# EAGLE design ardunio-physics-board-v3 (EAGLE 9.6.2)
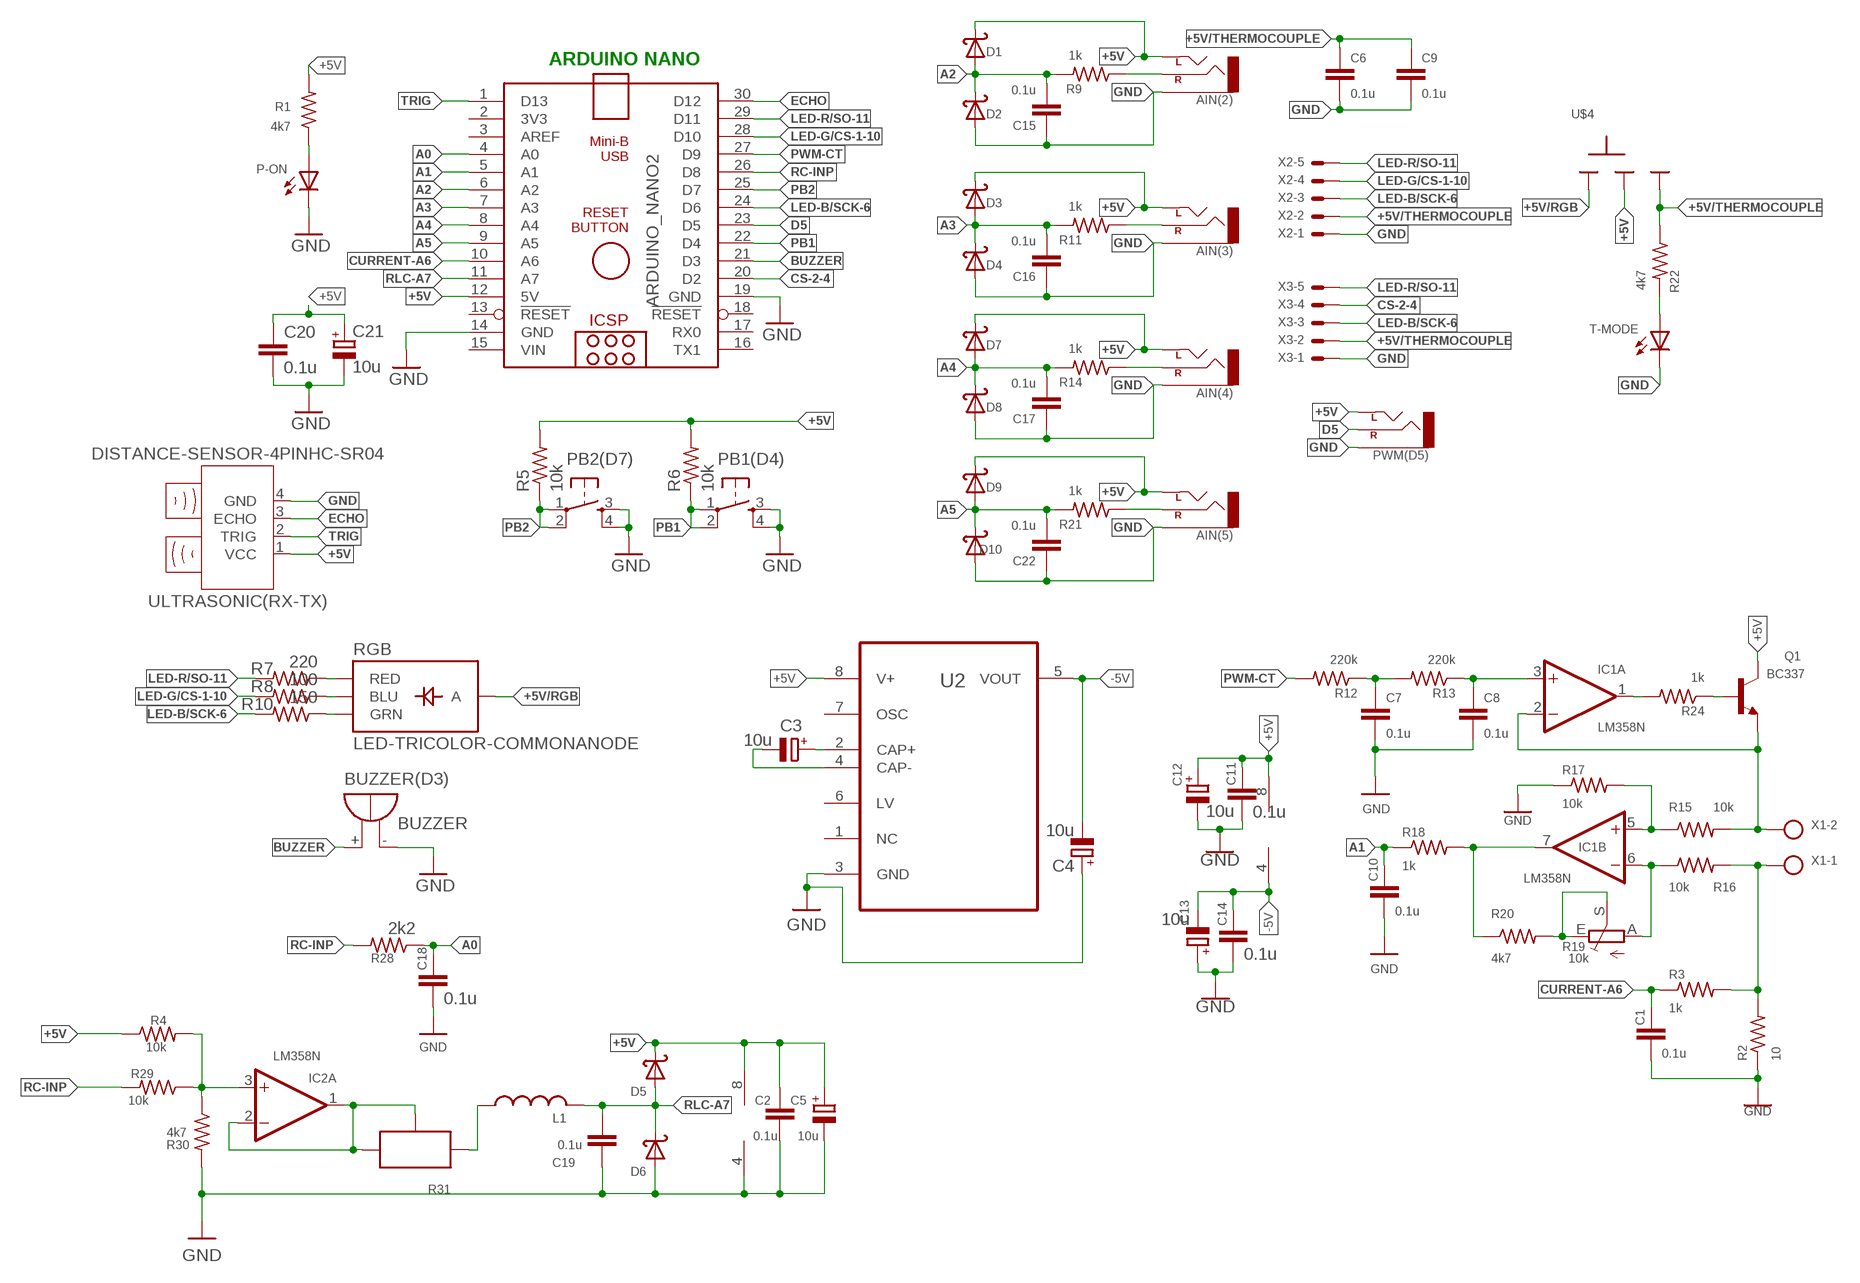
[diagram p0: schematic, sheet 1]

## Parts
AIN(2)  AUX-CONNECTOR_CEDT_JANUARY_2015_V5_AUDIO-JACKPTH  [AUX-CONNECTOR_CEDT_JANUARY_2015_V5_AUDIO-JACK]
AIN(3)  AUX-CONNECTOR_CEDT_JANUARY_2015_V5_AUDIO-JACKPTH  [AUX-CONNECTOR_CEDT_JANUARY_2015_V5_AUDIO-JACK]
AIN(4)  AUX-CONNECTOR_CEDT_JANUARY_2015_V5_AUDIO-JACKPTH  [AUX-CONNECTOR_CEDT_JANUARY_2015_V5_AUDIO-JACK]
AIN(5)  AUX-CONNECTOR_CEDT_JANUARY_2015_V5_AUDIO-JACKPTH  [AUX-CONNECTOR_CEDT_JANUARY_2015_V5_AUDIO-JACK]
ARDUINO_NANO2  ARDUINONANOV30_ARDUINO_NANO  [ARDUINONANOV30_ARDUINO_NANO]
BUZZER(D3)  BUZZER  [F/TMB]
C1  0.1u  C-EU025-025X050  [C025-025X050]
C2  0.1u  C-EU025-025X050  [C025-025X050]
C3  10u  CPOL-EUTT2D5  [TT2D5]
C4  10u  CPOL-EUTT2D5  [TT2D5]
C5  10u  CPOL-EUTT2D5  [TT2D5]
C6  0.1u  C-EU025-024X044  [C025-024X044]
C7  0.1u  C-EU025-025X050  [C025-025X050]
C8  0.1u  C-EU025-025X050  [C025-025X050]
C9  0.1u  C-EU025-024X044  [C025-024X044]
C10  0.1u  C-EU025-025X050  [C025-025X050]
C11  0.1u  C-EU025-025X050  [C025-025X050]
C12  10u  CPOL-EUTT2D5  [TT2D5]
C13  10u  CPOL-EUTT2D5  [TT2D5]
C14  0.1u  C-EU025-025X050  [C025-025X050]
C15  0.1u  C-EU025-024X044  [C025-024X044]
C16  0.1u  C-EU025-024X044  [C025-024X044]
C17  0.1u  C-EU025-024X044  [C025-024X044]
C18  0.1u  C-EU025-025X050  [C025-025X050]
C19  0.1u  C-EU025-025X050  [C025-025X050]
C20  0.1u  C-EU025-024X044  [C025-024X044]
C21  10u  CPOL-EUE2.5-5  [E2,5-5]
C22  0.1u  C-EU025-024X044  [C025-024X044]
D1  1N5819  [DO41-10]
D2  1N5819  [DO41-10]
D3  1N5819  [DO41-10]
D4  1N5819  [DO41-10]
D5  1N5819  [DO41-10]
D6  1N5819  [DO41-10]
D7  1N5819  [DO41-10]
D8  1N5819  [DO41-10]
D9  1N5819  [DO41-10]
D10  1N5819  [DO41-10]
IC1  LM358N  [DIL08]
IC2  LM358N  [DIL08]
L1  L-US6000-XXX-RC  [6000-XXXX-RC]
P-ON  LED3MM  [LED3MM]
PB1(D4)  OMRON_SWITCH_40-XX  [B3F-40XX]
PB2(D7)  OMRON_SWITCH_40-XX  [B3F-40XX]
PWM(D5)  AUX-CONNECTOR_CEDT_JANUARY_2015_V5_AUDIO-JACKPTH  [AUX-CONNECTOR_CEDT_JANUARY_2015_V5_AUDIO-JACK]
Q1  BC337  [TO92]
R1  4k7  R-US_0204/7  [0204/7]
R2  10  RESISTOR0207/10  [0207/10]
R3  1k  R-US_0204/7  [0204/7]
R4  10k  R-US_0207/10  [0207/10]
R5  10k  R-US_0204/7  [0204/7]
R6  10k  R-US_0204/7  [0204/7]
R7  220  R-US_0207/10  [0207/10]
R8  100  R-US_0207/10  [0207/10]
R9  1k  R-US_0204/7  [0204/7]
R10  150  R-US_0207/10  [0207/10]
R11  1k  R-US_0204/7  [0204/7]
R12  220k  R-US_0207/10  [0207/10]
R13  220k  R-US_0204/7  [0204/7]
R14  1k  R-US_0204/7  [0204/7]
R15  10k  R-US_0204/7  [0204/7]
R16  10k  R-US_0204/7  [0204/7]
R17  10k  R-US_0204/7  [0204/7]
R18  1k  R-US_0204/7  [0204/7]
R19  10k  TRIM_EU-RJ9W  [RJ9W]
R20  4k7  R-US_0204/7  [0204/7]
R21  1k  R-US_0204/7  [0204/7]
R22  4k7  R-US_0204/7  [0204/7]
R24  1k  R-US_0204/7  [0204/7]
R28  2k2  R-US_0207/10  [0207/10]
R29  10k  R-US_0204/7  [0204/7]
R30  4k7  R-US_0207/10  [0207/10]
R31  POTNORMAL  [RJ9W]
RGB  LED-TRICOLOR-COMMONANODE  [LED-TRICOLOR-THROUGHHOLE]
T-MODE  LED3MM  [LED3MM]
U2  ICL7660CPAZ_ICL7660CPAZ  [ICL7660CPAZ_DIP254P762X533-8]
U$4  SLIDESWITCH-BIG  [BIGSWITCH]
ULTRASONIC(RX-TX)  DISTANCE-SENSOR-4PINHC-SR04  [HC-SR04]
X1  AK500/2-H  [AK500/2-H]
X2  JST-XH-05-PIN-LONG-PAD  [JST-XH-05-PACKAGE-LONG-PAD]
X3  JST-XH-05-PIN-LONG-PAD  [JST-XH-05-PACKAGE-LONG-PAD]

## Nets
+5V [POWER]: AIN(2).TIP(LEFT) AIN(3).TIP(LEFT) AIN(4).TIP(LEFT) AIN(5).TIP(LEFT) ARDUINO_NANO2.12(5V) C2.1 C5.+ C11.1 C12.+ C20.1 C21.+ D1.C D3.C D5.C D7.C D9.C IC1.8(P:V+) IC2.8(P:V+) PWM(D5).TIP(LEFT) Q1.3(C) R1.2 R4.1 R5.2 R6.2 U2.8(V+) U$4.2 ULTRASONIC(RX-TX).1(VCC)
+5V/RGB: RGB.ANODE(A) U$4.1
+5V/THERMOCOUPLE: C6.1 C9.1 R22.1 U$4.3 X2.2 X3.2
-5V: C4.- C13.- C14.1 IC1.4(P:V-) U2.5(VOUT)
A0: ARDUINO_NANO2.4(A0) C18.1 R28.1
A1: ARDUINO_NANO2.5(A1) C10.1 R18.1
A2: ARDUINO_NANO2.6(A2) C15.2 D1.A D2.C R9.2
A3: ARDUINO_NANO2.7(A3) C16.2 D3.A D4.C R11.2
A4: ARDUINO_NANO2.8(A4) C17.2 D7.A D8.C R14.2
A5: ARDUINO_NANO2.9(A5) C22.2 D9.A D10.C R21.2
BUZZER: ARDUINO_NANO2.21(D3) BUZZER(D3).+
CS-2-4: ARDUINO_NANO2.20(D2) X3.4
CURRENT-A6: ARDUINO_NANO2.10(A6) C1.1 R3.1
D5: ARDUINO_NANO2.23(D5) PWM(D5).RING(RIGHT)
ECHO: ARDUINO_NANO2.30(D12) ULTRASONIC(RX-TX).3(ECHO)
GND [POWER]: AIN(2).SLEEVE AIN(3).SLEEVE AIN(4).SLEEVE AIN(5).SLEEVE ARDUINO_NANO2.14(GND) ARDUINO_NANO2.19(GND) BUZZER(D3).- C1.2 C2.2 C4.+ C5.- C6.2 C7.2 C8.2 C9.2 C10.2 C11.2 C12.- C13.+ C14.2 C15.1 C16.1 C17.1 C18.2 C19.2 C20.2 C21.- C22.1 D2.A D4.A D6.A D8.A D10.A IC2.4(P:V-) P-ON.K(C) PB1(D4).3(S) PB1(D4).4(S1) PB2(D7).3(S) PB2(D7).4(S1) PWM(D5).SLEEVE R2.1 R17.1 R30.2 T-MODE.K(C) U2.3(GND) ULTRASONIC(RX-TX).4(GND) X2.1 X3.1
LED-B/SCK-6: ARDUINO_NANO2.24(D6) R10.2 X2.3 X3.3
LED-G/CS-1-10: ARDUINO_NANO2.28(D10) R8.2 X2.4
LED-R/SO-11: ARDUINO_NANO2.29(D11) R7.2 X2.5 X3.5
N$1: IC1.2(A:-IN) Q1.1(E) R15.2 X1.2
N$2: R7.1 RGB.RED
N$3: R8.1 RGB.BLU
N$4: R10.1 RGB.GRN
N$5: IC1.1(A:OUT) R24.2
N$6: C8.1 IC1.3(A:+IN) R13.1
N$7: IC2.3(A:+IN) R4.2 R29.1 R30.1
N$9: C3.+ U2.2(CAP+)
N$10: C3.- U2.4(CAP-)
N$11: C7.1 R12.1 R13.2
N$12: R2.2 R3.2 R16.2 X1.1
N$13: P-ON.A R1.1
N$14: Q1.2(B) R24.1
N$15: IC2.1(A:OUT) IC2.2(A:-IN) R31.A R31.S
N$16: AIN(2).RING(RIGHT) R9.1
N$17: IC1.5(B:+IN) R15.1 R17.2
N$18: IC1.6(B:-IN) R16.1 R19.A
N$20: R19.E R19.S R20.2
N$21: IC1.7(B:OUT) R18.2 R20.1
N$22: AIN(3).RING(RIGHT) R11.1
N$27: R22.2 T-MODE.A
N$28: L1.1 R31.E
N$29: AIN(4).RING(RIGHT) R14.1
N$31: AIN(5).RING(RIGHT) R21.1
PB1: ARDUINO_NANO2.22(D4) PB1(D4).1(P) PB1(D4).2(P1) R6.1
PB2: ARDUINO_NANO2.25(D7) PB2(D7).1(P) PB2(D7).2(P1) R5.1
PWM-CT: ARDUINO_NANO2.27(D9) R12.2
RC-INP: ARDUINO_NANO2.26(D8) R28.2 R29.2
RLC-A7: ARDUINO_NANO2.11(A7) C19.1 D5.A D6.C L1.2
TRIG: ARDUINO_NANO2.1(D13) ULTRASONIC(RX-TX).2(TRIG)
Unconnected: ARDUINO_NANO2.2(3V3) ARDUINO_NANO2.3(AREF) ARDUINO_NANO2.13(!RESET) ARDUINO_NANO2.16(TX1) ARDUINO_NANO2.17(RX0) ARDUINO_NANO2.18(!RESET) IC2.5(B:+IN) IC2.6(B:-IN) IC2.7(B:OUT) U2.1(NC) U2.6(LV) U2.7(OSC)

## Notes on the sheet
- ARDUINO NANO

## Power pins joined to a net without a drawn wire
VIN: ARDUINO_NANO2.15(VIN)

## Library data of the parts
AIN(2) AIN(3) AIN(4) AIN(5) PWM(D5) = aux-connector:AUX-CONNECTOR_CEDT_JANUARY_2015_V5_AUDIO-JACK: 3.5mm Audio Jack Simple 3.5mm common PCB mount audio jack. SKU: PRT-08032
ARDUINO_NANO2 = nano:ARDUINONANOV30_ARDUINO_NANO: Arduino Nano V3.0 Overview: The Arduino Nano is a small, complete, and breadboard-friendly board based on the ATmega328 (Arduino Nano 3.x) or ATmega168 (Arduino Nano 2.x). It has more or less the same functionality of the Arduino Duemilanove, but in a different package. It lacks only a DC power jack, and works with a Mini-B USB cable instead of a standard one. The Nano was designed and is being produced by Gravitech. Specifications: Microcontroller Atmel ATmega168 or ATmega328 Operating Voltage (logic level) 5 V Input Voltage (recommended) 7-12 V Input Voltage (limits) 6-20 V Digital I/O Pins 14 (of which 6 provide PWM output) Analog Input Pins 8 DC Current per I/O Pin 40 mA Flash Memory 16 KB (ATmega168) or 32 KB (ATmega328) of which 2 KB used by bootloader SRAM 1 KB (ATmega168) or 2 KB (ATmega328) EEPROM 512 bytes (ATmega168) or 1 KB (ATmega328) Clock Speed 16 MHz Dimensions 0.73" x 1.70" Length 45 mm Width 18 mm Weigth 5 g Power: The Arduino Nano can be powered via the Mini-B USB connection, 6-20V unregulated external power supply (pin 30), or 5V regulated external power supply (pin 27). The power source is automatically selected to the highest voltage source. Memory: The ATmega168 has 16 KB of flash memory for storing code (of which 2 KB is used for the bootloader); the ATmega328 has 32 KB, (also with 2 KB used for the bootloader). The ATmega168 has 1 KB of SRAM and 512 bytes of EEPROM (which can be read and written with the EEPROM library); the ATmega328 has 2 KB of SRAM and 1 KB of EEPROM. Input and Output: Each of the 14 digital pins on the Nano can be used as an input or output, using pinMode(), digitalWrite(), and digitalRead() functions. They operate at 5 volts. Each pin can provide or receive a maximum of 40 mA and has an internal pull-up resistor (disconnected by default) of 20-50 kOhms. In addition, some pins have specialized functions. Visit Arduino - ArduinoBoardNano <https://www.arduino.cc/en/Main/ArduinoBoardNano>
BUZZER(D3) = CEDT_JANUARY_2015_v5:BUZZER: BUZZER Source: Buerklin; OC_FARNELL: unknown; OC_NEWARK: unknown
C1 C2 C6-C11 C14-C20 C22 = rcl:C-EU: CAPACITOR, European symbol; SPICEPREFIX: C
C3-C5 C12 C13 C21 = rcl:CPOL-EU: POLARIZED CAPACITOR, European symbol; SPICEPREFIX: C
D1-D10 = CEDT_JANUARY_2015_v5:1N5819: DIODE general purpose rectifier, 1 A
IC1 IC2 = CEDT_JANUARY_2015_v5:LM358: OP AMP also LM158; LM258; LM2904 Source: http://cache.national.com/ds/LM/LM158.pdf
L1 = rcl:L-US: INDUCTOR, American symbol; SPICEPREFIX: L
P-ON T-MODE = CEDT:LED; OC_FARNELL: unknown
PB1(D4) PB2(D7) = CEDT_JANUARY_2015_v5:OMRON_SWITCH
Q1 = transistor-npn:BC337*: NPN Transistor
R1 R3-R18 R20-R22 R24 R28-R30 = rcl:R-US_: RESISTOR, American symbol; SPICEPREFIX: R
R2 = CEDT_JANUARY_2015_v5:RESISTOR
R19 = pot:TRIM_EU-: POTENTIOMETER
R31 = CEDT_JANUARY_2015_v5:POT
RGB = CEDT_JANUARY_2015_v5:LED-TRICOLOR-COMMONANODE
U2 = CurveTracer_V6:ICL7660CPAZ_ICL7660CPAZ: CMOS Voltage Converters Check prices <https://pricing.snapeda.com/parts/ICL7660CPAZ/Renesas%20Electronics/view-part?ref=eda>; AVAILABILITY: In Stock; DESCRIPTION: Charge Pump Switching Regulator IC Positive or Negative Fixed -Vin, 2Vin 1 Output 45mA 8-DIP (0.300, 7.62mm); MF: Renesas Electronics; MP: ICL7660CPAZ; PACKAGE: DIP-8 Intersil; PRICE: None
U$4 = CEDT_JANUARY_2015_v5:SLIDESWITCH
ULTRASONIC(RX-TX) = Tinkercad:DISTANCE-SENSOR-4PIN
X1 = con-ptr500:AK500/2-H: CONNECTOR Aug. 2004 / PTR Meßtechnik: Die Bezeichnung der Serie AK505 wurde geändert. Es handelt sich hierbei um AK500 in horizontaler Ausführung.; OC_FARNELL: unknown; OC_NEWARK: unknown
X2 X3 = Rembrandt Electronics - JST XH Connectors v1-0:JST-XH-05-PIN: JST XH Connector 2 Pin Wire to board connector. Pitch: 2,54 mm, (0.100") Number of pins: 5 Created by Rembrandt Electronics www.rembrandtelectronics.com

## Net classes
0 default: width 0.813 mm
1 POWER: width 1.016 mm

## Board
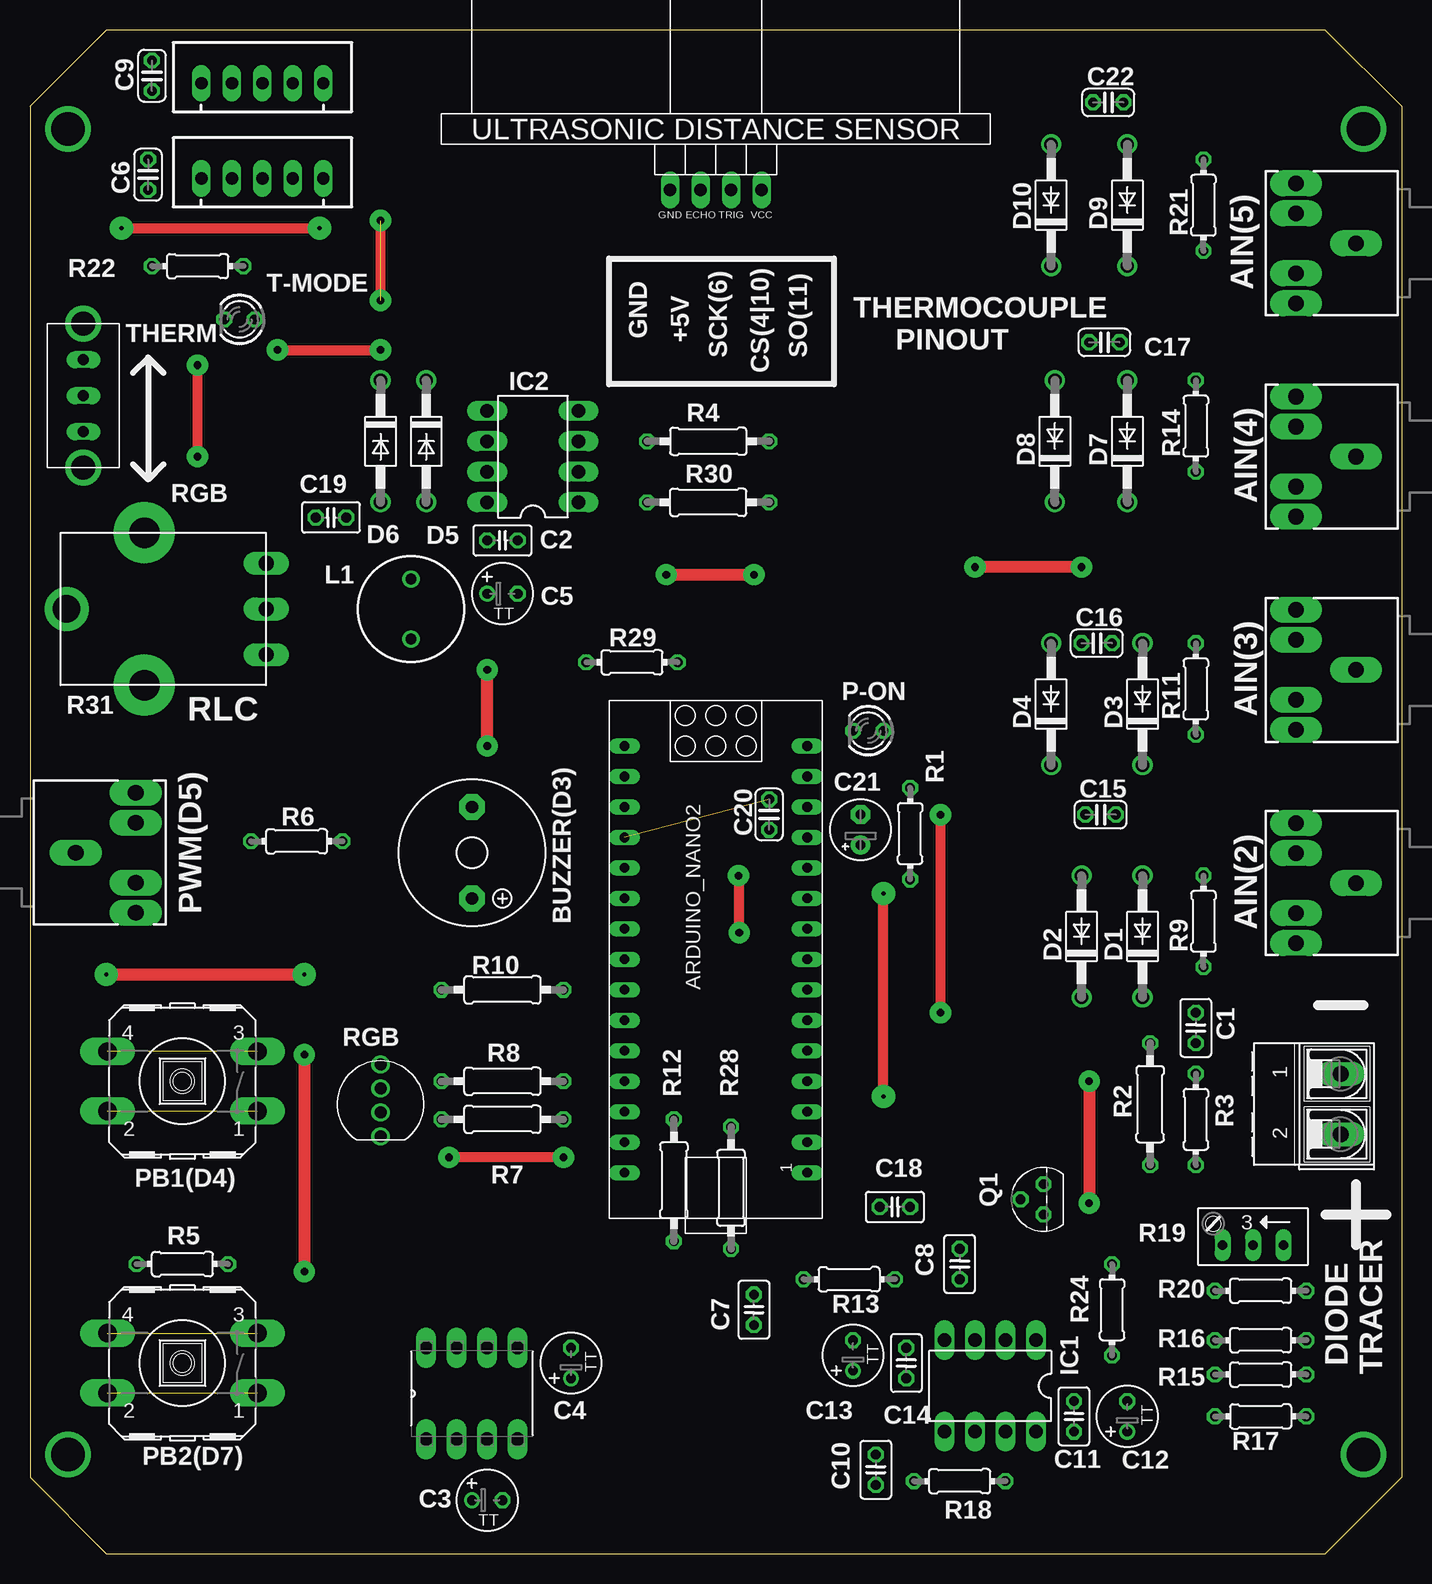
[diagram p1: board, top side]
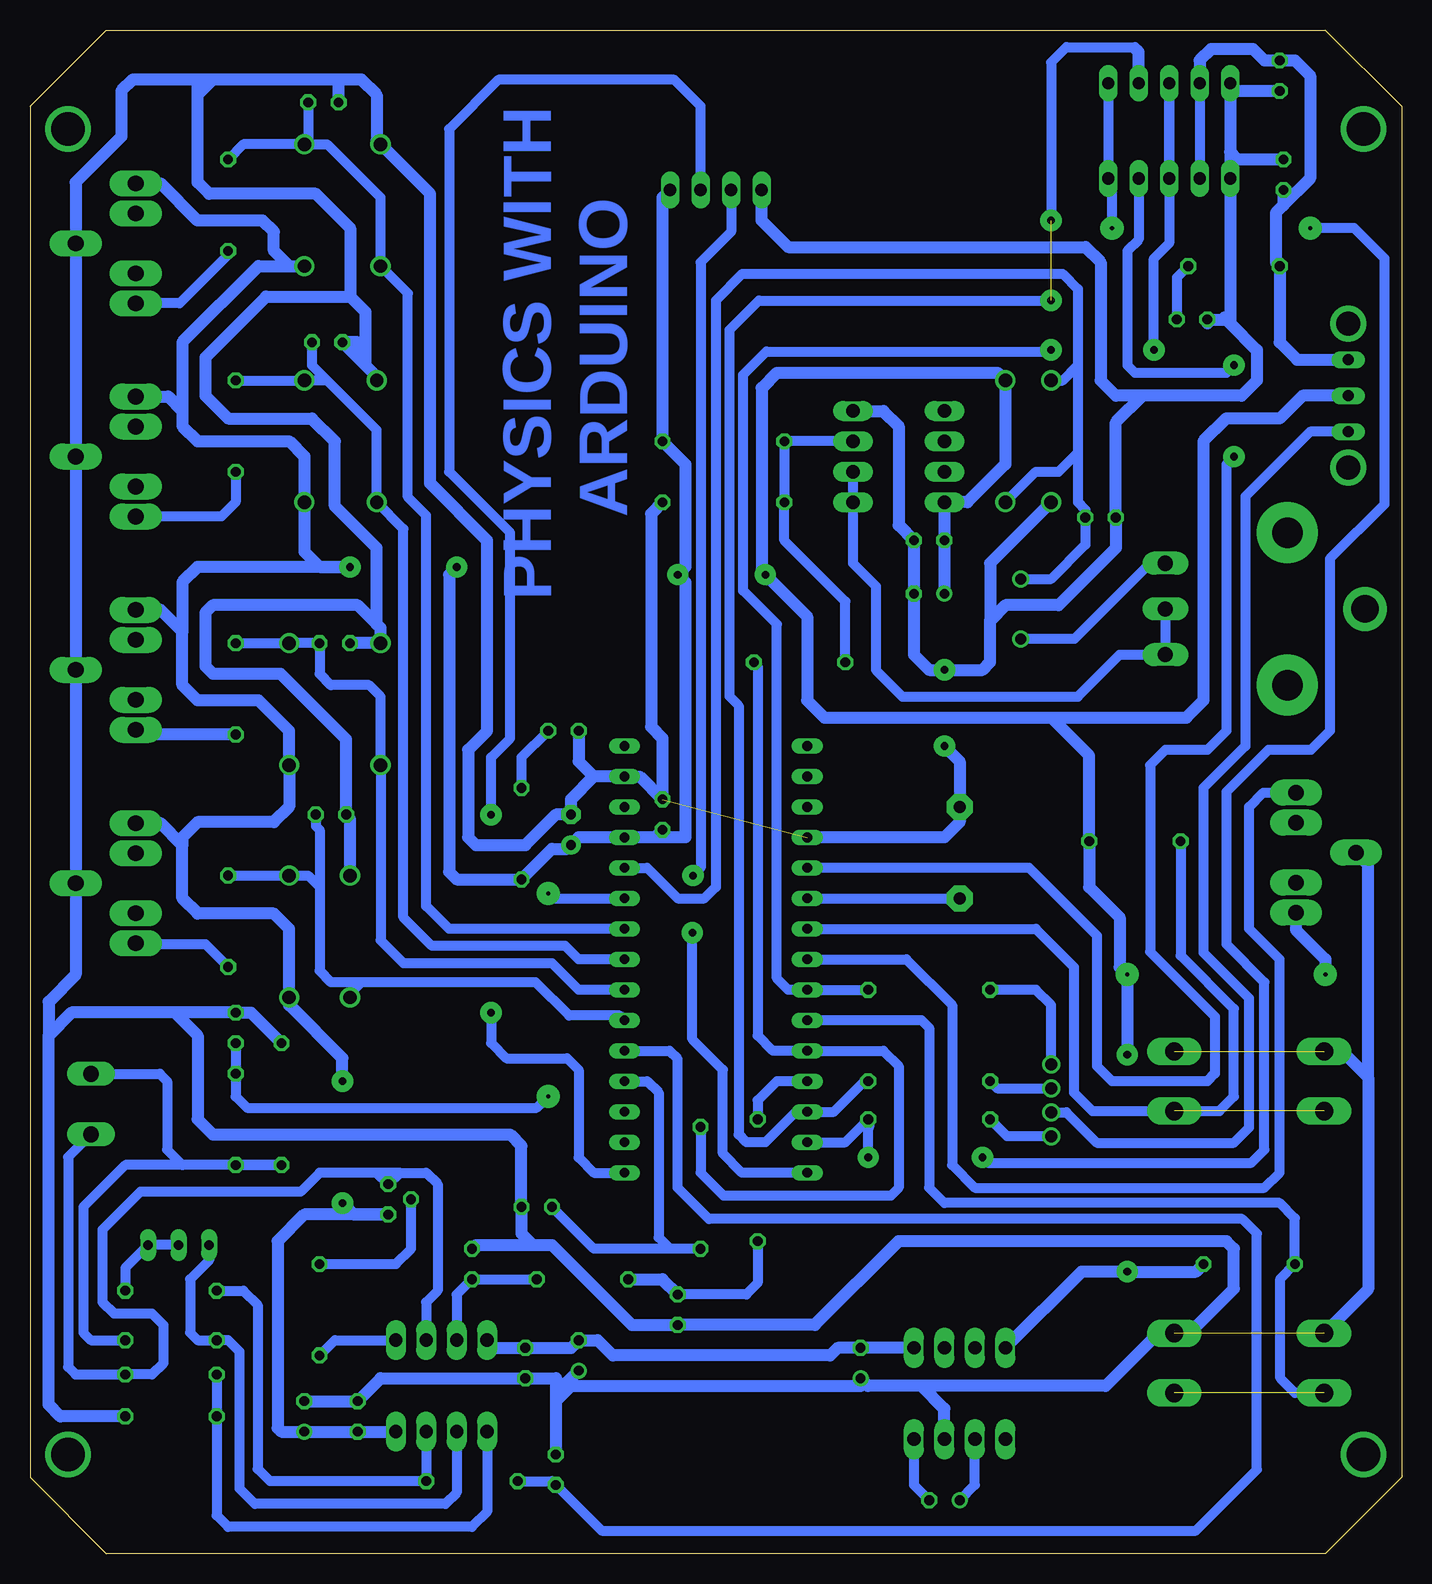
[diagram p2: board, bottom side, seen from below]

Size 114.3 x 127 mm. Coordinates in mm from the lower left corner, seen from the top.
Outline: 6.35,0 107.95,0 114.3,6.35 114.3,120.65 107.95,127 6.35,127 0,120.65 0,6.35 6.35,0
Copper layers (1*16): Top 0.035mm / dielectric 1.5mm / Bottom 0.035mm
Design rules "default *": minimum track width 6mil, minimum drill 0.35mm, track to track 12mil, track to pad 12mil, pad to pad 12mil, via to via 12mil, smd to smd 12mil, copper to edge 40mil, drill to drill 6mil, minimum pad ring 10mil, minimum via ring 8mil, stop-mask expansion 4mil, vias tented up to drill 0mil, thermal gap 10mil

### Footprints (pad centres in the part's own frame; a part is rotated, then mirrored left to right if it is on the bottom)
AUX-CONNECTOR_CEDT_JANUARY_2015_V5_AUDIO-JACK = drill 1.3 pad 2.184 long: RING 5,5; RSH 5,2.5; SLEEVE 0,0; TIP 5,-5; TSH 5,-2.5
ARDUINONANOV30_ARDUINO_NANO = drill 0.8 long: 1 16.51,3.81; 2 16.51,6.35; 3 16.51,8.89; 4 16.51,11.43; 5 16.51,13.97; 6 16.51,16.51; 7 16.51,19.05; 8 16.51,21.59; 9 16.51,24.13; 10 16.51,26.67; 11 16.51,29.21; 12 16.51,31.75; 13 16.51,34.29; 14 16.51,36.83; 15 16.51,39.37; 16 1.27,39.37; 17 1.27,36.83; 18 1.27,34.29; 19 1.27,31.75; 20 1.27,29.21; 21 1.27,26.67; 22 1.27,24.13; 23 1.27,21.59; 24 1.27,19.05; 25 1.27,16.51; 26 1.27,13.97; 27 1.27,11.43; 28 1.27,8.89; 29 1.27,6.35; 30 1.27,3.81
F/TMB = drill 1.016 pad 2.159 octagon: + 3.81,0; - -3.81,0
C025-025X050 = drill 0.813 octagon: 1 -1.27,0; 2 1.27,0
TT2D5 = drill 0.813: + -1.27,0 | drill 0.813 octagon: - 1.27,0
C025-024X044 = drill 0.813 octagon: 1 -1.27,0; 2 1.27,0
E2,5-5 = drill 0.813 pad 1.6: + -1.27,0 | drill 0.813 pad 1.6 octagon: - 1.27,0
DO41-10 = drill 1.118: A 5.08,0; C -5.08,0
DIL08 = drill 1.118 long: 1 -3.81,-3.81; 2 -1.27,-3.81; 3 1.27,-3.81; 4 3.81,-3.81; 5 3.81,3.81; 6 1.27,3.81; 7 -1.27,3.81; 8 -3.81,3.81
6000-XXXX-RC = drill 0.9 pad 1.422: 1 -2.5,0; 2 2.5,0
LED3MM = drill 0.813 octagon: A -1.27,0; K 1.27,0
B3F-40XX = drill 1.524 long: 1 -6.248,2.489; 2 6.248,2.489; 3 -6.248,-2.489; 4 6.248,-2.489
TO92 = drill 0.813 octagon: 1 1.27,0; 2 0,1.905; 3 -1.27,0
0204/7 = drill 0.813 octagon: 1 -3.81,0; 2 3.81,0
0207/10 = drill 0.813 octagon: 1 -5.08,0; 2 5.08,0
RJ9W = drill 0.813 long: A 2.54,0.635; E -2.54,0.635; S 0,0.635
RJ9W' = drill 1.27 long: A 3.81,8.255; E -3.81,8.255; S 0,8.255 | drill 2.286 pad 3.658: P$1 0,-8.382 | drill 2.54 pad 5.08: P$3 6.35,-1.905; P$4 -6.35,-1.905
LED-TRICOLOR-THROUGHHOLE = drill 1: ANODE -1,0; BLU 1,0; GRN 3,0; RED -3,0
ICL7660CPAZ_DIP254P762X533-8 = drill 1.118 long: 1 -7.62,7.62; 2 -7.62,5.08; 3 -7.62,2.54; 4 -7.62,0; 5 0,0; 6 0,2.54; 7 0,5.08; 8 0,7.62
BIGSWITCH = drill 0.9 long: 1 -3,0; 2 0,0; 3 3,0 | drill 2 pad 2.184: TAB1 -6,0; TAB2 6,0
HC-SR04 = drill 1.016 long: 1 -3.81,0; 2 -1.27,0; 3 1.27,0; 4 3.81,0
AK500/2-H = drill 1.321 long: 1 -2.515,0; 2 2.515,0
JST-XH-05-PACKAGE-LONG-PAD = drill 1.016 long: 1 -5.08,0; 2 -2.54,0; 3 0,0; 4 2.54,0; 5 5.08,0

### Placement (x,y rotation side)
AIN(2)  110.49,55.88 180 top
AIN(3)  110.49,73.66 180 top
AIN(4)  110.49,91.44 180 top
AIN(5)  110.49,109.22 180 top
ARDUINO_NANO2  48.26,27.94 0 top
BUZZER(D3)  36.83,58.42 270 top
C1  97.16,43.81 90 top
C2  39.37,84.45 0 top
C3  38.1,4.45 0 top
C4  45.09,15.88 90 top
C5  39.37,80.01 0 top
C6  9.84,114.94 90 top
C7  60.33,20.32 270 top
C8  77.47,24.13 90 top
C9  10.16,123.19 270 top
C10  70.48,6.99 90 top
C11  87,11.43 90 top
C12  91.44,11.43 90 top
C13  68.58,16.51 90 top
C14  73.03,15.88 270 top
C15  89.22,61.59 0 top
C16  88.9,75.88 0 top
C17  89.53,100.97 0 top
C18  72.07,28.89 0 top
C19  25.08,86.36 180 top
C20  61.59,61.59 90 top
C21  69.22,60.33 90 top
C22  89.85,120.97 0 top
D1  92.71,51.44 90 top
D2  87.63,51.44 90 top
D3  92.71,70.8 90 top
D4  85.09,70.8 90 top
D5  33.02,92.71 270 top
D6  29.21,92.71 270 top
D7  91.44,92.71 90 top
D8  85.41,92.71 90 top
D9  91.44,112.39 90 top
D10  85.09,112.39 90 top
IC1  80.01,13.97 180 top
IC2  41.91,91.44 90 top
L1  31.75,78.74 90 top
P-ON  69.85,68.58 180 top
PB1(D4)  12.7,39.37 180 top
PB2(D7)  12.7,15.88 180 top
PWM(D5)  3.81,58.42 0 top
Q1  84.45,29.53 90 top
R1  73.34,60.01 270 top
R2  93.34,37.47 270 top
R3  97.16,36.2 270 top
R4  56.52,92.71 180 top
R5  12.7,24.13 0 top
R6  22.23,59.37 0 top
R7  39.37,36.2 0 top
R8  39.37,39.37 0 top
R9  97.79,52.7 90 top
R10  39.37,46.99 0 top
R11  97.16,72.07 90 top
R12  53.66,31.11 90 top
R13  68.26,22.86 180 top
R14  97.16,93.98 90 top
R15  102.55,14.92 0 top
R16  102.55,17.78 0 top
R17  102.55,11.43 180 top
R18  77.47,6.03 0 top
R19  101.92,26.35 180 top
R20  102.55,21.91 0 top
R21  97.79,112.39 90 top
R22  13.97,107.31 0 top
R24  90.17,20.32 270 top
R28  58.42,30.48 90 top
R29  50.16,74.3 0 top
R30  56.52,87.63 0 top
R31  [RJ9W']  11.43,78.74 270 top
RGB  29.21,37.78 90 top
T-MODE  17.46,102.87 180 top
U2  40.64,17.14 90 top
U$4  4.45,96.52 90 top
ULTRASONIC(RX-TX)  57.15,113.67 180 top
X1  109.22,37.47 270 top
X2  19.37,122.56 0 top
X3  19.37,114.62 0 top

### Tracks (layer width: path | path; a pad name or v marks a point on that pad's centre or on a via)
+5V  (via drill 0.35 pad 1.93, 0.64 pad 1.78)
  Top 1.016: v88.27,39.37 v88.27,29.21 | v87.63,82.23 v78.74,82.23 | v22.86,41.59 v22.86,23.5 | v53.02,81.6 v60.33,81.6 | v6.35,48.26 v22.86,48.26
  Bottom 1.016: 91.12,107.31 D9.C 92.71,107.31 | 92.71,107.31 95.25,107.31 101.6,100.97 101.6,95.25 | C20.1 62.23,59.69 | IC1.8 C11.1 C12.+ 93.34,10.16 93.66,10.48 93.66,26.04 91.44,28.26 Q1.3 87.31,28.26 v88.27,29.21 | 62.23,59.69 59.69,59.69 59.69,80.96 v60.33,81.6 59.69,82.23 59.69,90.81 R4.1 61.59,113.03 ULTRASONIC(RX-TX).1 | C5.+ C2.1 IC2.8 36.2,87.63 33.02,90.81 D5.C 33.66,98.42 52.07,98.42 53.34,97.16 53.34,81.92 v53.02,81.6 49.53,78.11 49.53,71.12 48.09,69.69 29.21,69.69 | R5.2 17.14,23.5 v22.86,23.5 26.67,23.5 U2.8 | 29.21,69.69 17.95,69.69 16.51,71.12 16.51,92.71 14.61,94.61 10.16,94.61 8.26,96.52 U$4.2 | v22.86,41.59 v22.86,48.26 23.5,48.9 23.5,53.02 26.04,55.56 R6.2 26.04,66.51 29.21,69.69 | v78.74,82.23 79.38,81.6 79.38,56.83 78.74,56.2 R1.2 70.8,58.74 69.53,58.74 C21.+ 68.58,59.69 ARDUINO_NANO2.12 62.23,59.69 | 101.6,95.25 101.6,93.98 100.33,92.71 92.71,92.71 91.44,91.44 D7.C 91.44,83.5 90.17,82.23 v87.63,82.23 100.33,82.23 101.6,80.96 101.6,76.83 | 101.6,76.83 101.6,72.39 100.33,71.12 95.25,71.12 92.71,68.58 D3.C 92.71,62.23 93.98,60.96 100.33,60.96 101.6,59.69 101.6,59.05 | 101.6,76.83 103.42,78.66 AIN(3).TIP 105.41,78.74 104.14,78.74 | 101.6,59.05 101.6,54.61 100.33,53.34 93.98,53.34 92.71,52.07 D1.C 92.71,45.72 88.27,41.27 v88.27,39.37 | 101.6,59.05 103.42,60.88 AIN(2).TIP | AIN(4).TIP 102.79,96.44 101.6,95.25 | PWM(D5).TIP 8.81,51.99 6.35,49.53 v6.35,48.26 | AIN(5).TIP 103.42,114.22 100.33,111.12 94.93,111.12 93.98,110.17 93.98,108.58 92.71,107.31
+5V/RGB
  Bottom 0.813: RGB.ANODE 27.94,36.78 25.4,34.24 13.97,34.24 12.7,35.51 12.7,46.29 16.51,50.1 16.51,63.82 13.02,67.31 13.02,88.12 7.62,93.52 U$4.1
+5V/THERMOCOUPLE
  Bottom 0.813: X2.2 X3.2
  Bottom 1.016: X2.2 16.83,124.46 15.88,125.41 12.38,125.41 11.43,124.46 C9.1 8.89,124.46 7.62,123.19 7.62,114.62 9.84,112.39 | C6.1 9.84,112.39 | 9.84,112.39 10.48,111.76 10.48,107.63 R22.1 10.16,100.97 8.71,99.52 U$4.3
-5V
  Bottom 1.016: IC1.4 75.56,17.14 C14.1 69.22,17.14 C13.- 66.99,17.78 65.72,16.51 47.62,16.51 46.99,17.14 C4.- U2.5
A0
  Bottom 0.813: ARDUINO_NANO2.4 62.87,39.37 61.91,38.42 61.91,26.35 60.96,25.4 | C18.1 67.31,25.4 60.96,25.4 | R28.1 60.96,25.4
A1
  Bottom 0.813: R18.1 70.8,6.03 C10.1 66.67,1.91 17.14,1.91 12.06,6.99 12.06,26.67 13.28,27.89 57.73,27.89 60.33,30.48 60.33,41.22 61.01,41.91 ARDUINO_NANO2.5
A2
  Bottom 0.813: 90.17,55.56 91.12,56.52 D1.A R9.2 | 90.17,55.56 90.17,48.58 89.22,47.62 86.68,47.62 | D2.C 87.63,46.67 86.68,47.62 | ARDUINO_NANO2.6 65.16,44.84 69.38,44.84 72.17,47.62 86.68,47.62 | C15.2 90.49,60.64 90.17,60.33 90.17,55.56
A3
  Bottom 0.813: R11.2 D3.A C16.2 90.17,73.34 89.22,72.39 86.04,72.39 85.09,71.44 D4.C 85.09,51.12 83.19,49.21 70.8,49.21 68.58,46.99 ARDUINO_NANO2.7
A4
  Bottom 0.813: R14.2 D7.A 89.53,97.79 | C17.2 90.81,99.06 89.53,97.79 | 89.53,97.79 85.41,93.66 D8.C 83.19,85.41 83.19,53.02 80.81,50.65 69.7,50.65 68.59,49.53 ARDUINO_NANO2.8
A5
  Bottom 0.813: D9.A 89.53,117.47 85.09,113.03 D10.C 82.82,105.04 82.82,88.08 81.28,86.54 81.28,53.98 79.38,52.07 ARDUINO_NANO2.9 | C22.2 91.12,117.79 D9.A | D9.A 96.52,117.47 R21.2
BUZZER
  Bottom 0.813: ARDUINO_NANO2.21 BUZZER(D3).+
CS-2-4  (via drill 0.64 pad 1.78)
  Top 0.813: v13.97,91.44 v13.97,99.06
  Bottom 0.813: v13.97,91.44 14.61,90.81 14.61,68.58 16.19,66.99 19.68,66.99 20.95,65.72 20.95,50.16 15.56,44.77 15.56,40.01 16.19,39.37 24.13,39.37 25.4,40.64 25.4,51.5 31.05,57.15 ARDUINO_NANO2.20 | v13.97,99.06 14.61,98.42 22.23,98.42 22.86,99.06 22.86,108.58 21.91,109.54 X3.4
CURRENT-A6  (via drill 0.35 pad 1.93)
  Top 0.813: v71.12,38.1 v71.12,55.02
  Bottom 0.813: C1.1 R3.1 97.16,38.1 96.2,37.15 72.07,37.15 v71.12,38.1 | v71.12,55.02 70.71,54.61 ARDUINO_NANO2.10
D5
  Bottom 0.813: ARDUINO_NANO2.23 41.27,49.53 37.47,45.72 37.47,32.38 35.56,30.48 11.43,30.48 10.16,31.75 10.16,49.53 12.7,52.07 12.7,62.23 11.51,63.42 PWM(D5).RING
ECHO  (via drill 0.64 pad 1.78)
  Top 0.813: v59.11,51.75 59.11,56.46 v59.05,56.52
  Bottom 0.813: ULTRASONIC(RX-TX).3 55.88,110.17 58.42,107.63 58.42,57.15 v59.05,56.52 | v59.11,51.75 59.11,42.86 56.57,40.32 56.57,33.34 54.98,31.75 ARDUINO_NANO2.30
GND  (via drill 0.64 pad 1.78)  (3 unrouted)
  Top 1.016: v38.1,67.31 v38.1,73.66
  Bottom 1.016: 88.58,122.87 86.68,122.87 85.41,121.6 85.41,117.79 D10.A 80.96,113.35 80.96,89.22 76.2,84.45 76.2,68.58 77.79,66.99 77.79,59.69 77.15,59.05 73.03,59.05 70.48,61.59 C21.- 69.22,62.87 67.31,64.77 | 86.36,99.06 85.41,98.11 D8.A | 67.31,64.77 ARDUINO_NANO2.14 63.5,64.77 C20.2 61.59,67.94 62.55,68.9 62.55,86.68 R30.2 | 67.31,64.77 68.58,66.04 P-ON.K | 87.63,104.78 87.63,110.49 90.49,113.35 99.38,113.35 100.33,114.3 100.33,121.6 | 87,100.97 86.36,100.97 | 87.63,104.78 94.61,104.78 99.69,99.69 99.69,96.52 97.79,94.61 90.81,94.61 88.9,92.71 88.9,87.31 85.41,83.82 85.41,77.47 | 87.63,104.78 86.36,103.5 86.36,100.97 | 86.36,100.97 86.36,100.33 | 86.36,100.33 86.36,99.06 | C12.- C11.2 85.09,14.61 C14.2 70.48,14.61 70.48,13.34 | U2.3 38.1,12.06 40.01,13.97 | 40.01,13.97 44.45,13.97 C4.+ 45.09,13.97 69.22,13.97 70.48,12.7 C10.2 70.48,13.34 | C8.2 77.15,25.72 72.39,25.72 | 72.39,25.72 70.8,25.72 64.14,19.05 C7.2 48.9,19.05 41.91,26.04 14.61,26.04 13.97,25.4 13.97,22.07 17.68,18.36 PB2(D7).3 20.27,18.36 24.66,13.97 40.01,13.97 | R17.1 111.76,11.43 112.76,12.43 112.76,43.18 | C13.+ 70.48,13.34 | 2.79,39.69 2.79,22.02 PB2(D7).4 | IC2.4 43.18,95.25 41.91,93.98 41.91,85.72 C2.2 C5.- 40.64,74.93 39.37,73.66 v38.1,73.66 34.92,73.66 34.29,74.3 34.29,77.79 | D6.A 34.29,82.55 34.29,77.79 | 88.58,122.87 99.06,122.87 | 99.38,122.87 100.33,122.87 | C22.1 88.58,122.87 | C16.1 D4.A 85.09,77.15 85.41,77.47 | 85.41,77.47 87,79.06 99.06,79.06 99.69,78.42 99.69,73.98 99.06,73.34 93.43,73.34 87.95,67.86 C15.1 88.04,61.59 87.63,61.19 D2.A | PB1(D4).4 4.97,41.86 2.79,39.69 | T-MODE.K 14.92,102.87 14.76,103.03 14.61,102.87
  Bottom 1.016: ULTRASONIC(RX-TX).4 53.34,111.12 51.12,108.9 26.35,108.9 25.08,107.63 25.08,97.79 23.81,96.52 21.59,96.52 | 100.33,121.6 100.33,121.92 | 100.33,121.92 100.33,122.87 | 86.36,99.06 C17.1 87,100.97 | 86.36,100.33 87,100.97 | ARDUINO_NANO2.19 38.1,59.69 36.83,60.96 BUZZER(D3).- 36.83,66.04 v38.1,67.31 | R2.1 95.89,45.09 C1.2 102.23,45.09 | C9.2 14.29,121.92 X2.1 14.29,116.84 | 14.29,116.84 X3.1 14.29,102.55 | C6.2 13.65,116.2 14.29,116.84 | T-MODE.K 16.19,102.55 | 21.59,96.52 13.34,96.52 12.06,97.79 12.06,100.33 14.29,102.55 | T-MODE.K 14.61,102.87 | 2.79,39.69 2.79,57.4 PWM(D5).SLEEVE | 72.39,25.72 73.34,26.67 C18.2 73.34,33.97 74.3,34.92 99.06,34.92 100.33,36.2 100.33,43.18 102.23,45.09 | 14.29,102.55 14.61,102.87 | 21.59,96.52 23.81,94.3 C19.2 23.81,83.82 28.57,79.06 33.02,79.06 34.29,77.79 | 102.23,45.09 110.85,45.09 112.76,43.18 | 112.76,43.18 112.76,45.99 110.49,48.26 AIN(2).SLEEVE AIN(3).SLEEVE AIN(4).SLEEVE AIN(5).SLEEVE 110.49,114.3 106.68,118.11 106.68,121.92 105.73,122.87 100.33,122.87 | 99.06,122.87 99.38,122.87 | 99.38,122.87 100.33,121.92 | 99.06,122.87 100.33,121.6
LED-B/SCK-6  (via drill 0.64 pad 1.78)
  Top 0.813: v20.64,100.33 v29.21,100.33
  Bottom 0.813: v29.21,100.33 29.34,100.2 52.93,100.2 54.86,98.27 54.86,80.26 52.07,77.47 52.07,47.94 51.12,46.99 ARDUINO_NANO2.24 R10.2 | v20.64,100.33 20.64,107.95 19.37,109.22 X2.3 X3.3
LED-G/CS-1-10  (via drill 0.64 pad 1.78)  (2 unrouted)
  Top 0.813: v29.21,104.46 v29.21,111.12
  Bottom 0.813: v29.21,104.46 53.56,104.46 56.01,102.01 56.01,71.44 55.24,70.68 55.24,34.92 54.61,34.29 53.02,34.29 50.48,36.83 ARDUINO_NANO2.28 47.31,36.83 44.61,39.53 R8.2 | v29.21,111.12 29.21,124.31 27.94,125.58 22.23,125.58 21.91,125.26 21.91,123.19
  Bottom 1.016: X2.4 21.91,123.19 21.91,125.16 22.23,125.48
LED-R/SO-11  (via drill 0.35 pad 1.93, 0.64 pad 1.78)
  Top 0.813: v44.45,33.02 v34.92,33.02 | v7.62,110.49 v24.13,110.49
  Bottom 0.813: v34.92,33.02 34.48,32.58 12.51,32.58 11.43,33.66 11.43,47.62 14.61,50.8 14.61,63.5 11.11,66.99 7.56,66.99 5.97,68.58 5.97,82.93 1.42,87.48 1.42,107.95 3.96,110.49 v7.62,110.49 | v44.45,33.02 44.45,35.56 | X2.5 24.45,115.57 | 24.45,115.57 X3.5 | ARDUINO_NANO2.29 46.35,34.29 R7.2 | v24.13,110.49 24.13,115.25 24.45,115.57
  Bottom 1.016: R7.2 44.45,35.56
N$1
  Bottom 0.813: X1.2 111.12,33.05 111.12,15.56 110.49,14.92 R15.2 104.14,14.92 103.19,15.88 103.19,19.05 104.14,20 107.31,20 108.27,20.95 108.27,26.99 105.09,30.16 91.76,30.16 90.17,31.75 85.41,31.75 | 85.41,31.75 Q1.1 83.5,31.75 | 83.5,31.75 85.41,31.75 | 83.5,31.75 81.28,31.75 80.33,30.8 80.33,21.91 81.28,20.95 IC1.2
N$2
  Bottom 0.813: RGB.RED 32.88,34.78 R7.1
N$3
  Bottom 0.813: R8.1 33.7,38.78 RGB.BLU
N$4
  Bottom 0.813: R10.1 30.48,46.99 29.21,45.72 RGB.GRN
N$5
  Bottom 0.813: R24.2 88.9,17.78 IC1.1
N$6
  Bottom 0.813: R13.1 C8.1 78.74,21.59 IC1.3
N$7
  Bottom 0.813: IC2.3 R4.2 R30.1 51.44,84.45 46.35,79.38 R29.1
N$8  (via drill 2.79 pad 3.81)
  other vias: 111.12,118.75
N$9
  Bottom 0.813: C3.+ 35.56,5.71 U2.2
N$10
  Bottom 0.813: U2.4 40.64,5.71 C3.-
N$11
  Bottom 0.813: R12.1 53.66,22.54 54.61,21.59 C7.1
  Bottom 1.016: R13.2 61.59,22.86 C7.1
N$12
  Bottom 0.813: R3.2 R2.2 101.6,32.38 | 101.6,32.38 106.36,32.38 109.86,28.89 109.86,18.41 109.22,17.78 R16.2 | X1.1 103.48,39.98 102.87,39.37 102.87,33.66 101.6,32.38
N$13
  Bottom 0.813: P-ON.A 73.34,66.36 R1.1
N$14
  Bottom 0.813: Q1.2 82.55,25.4 83.82,24.13 R24.1
N$15
  Bottom 0.813: IC2.2 IC2.1 45.72,82.55 43.81,80.64 43.81,73.66 41.59,71.44 26.99,71.44 23.5,74.93 R31.A R31.S
N$16
  Bottom 0.813: AIN(2).RING 105.49,50.8 99.69,50.8 R9.1
N$17
  Bottom 0.813: R15.1 R17.2 98.74,3.17 97.79,2.22 77.47,2.22 76.2,3.49 IC1.5
N$18
  Bottom 0.813: R19.A 99.38,24.45 100.97,22.86 100.97,18.41 100.33,17.78 R16.1 97.79,17.78 96.84,16.83 96.84,5.4 95.57,4.13 79.69,4.13 78.74,5.08 IC1.6
N$19  (via drill 2.79 pad 3.81)
  other vias: 3.17,118.75
N$20
  Bottom 0.813: R19.S R19.E 106.36,23.81 R20.2
N$21
  Bottom 0.813: IC1.7 R18.2 94.3,6.03 95.33,7.06 95.33,20.71 96.52,21.91 R20.1
N$22
  Bottom 1.016: R11.1 105.09,68.26 AIN(3).RING
N$24  (via drill 2.79 pad 3.81)
  other vias: 3.17,8.26
N$26  (via drill 2.79 pad 3.81)
  other vias: 111.12,8.26
N$27
  Bottom 0.813: R22.2 18.73,106.36 T-MODE.A
N$28
  Bottom 0.813: R31.E 20.95,82.55 27.27,76.24 L1.1
N$29
  Bottom 0.813: R14.1 97.16,87.63 98.34,86.44 AIN(4).RING
N$31
  Bottom 0.813: AIN(5).RING 101.84,104.22 97.79,108.27 R21.1
PB1  (1 unrouted)
  Bottom 0.813: R6.1 18.41,49.85 13.97,45.4 13.97,38.1 15.19,36.88 PB1(D4).1 25.77,36.88 27.3,38.42 27.3,48.9 30.48,52.07 ARDUINO_NANO2.22
PB2  (1 unrouted)
  Bottom 0.813: PB2(D7).2 8.89,13.39 10.11,14.61 10.11,22.91 R5.1 8.89,27.94 10.16,29.21 38.1,29.21 39.37,30.48 39.37,43.81 40.01,44.45 ARDUINO_NANO2.25
PWM-CT
  Bottom 0.813: R12.2 53.66,37.78 52.07,39.37 ARDUINO_NANO2.27
RC-INP
  Bottom 0.813: R29.2 53.66,73.98 53.66,43.18 52.39,41.91 ARDUINO_NANO2.26 43.18,41.91 41.91,40.64 41.91,30.48 42.55,29.84 56.52,29.84 58.42,31.75 R28.2
RLC-A7
  Bottom 0.813: 26.99,99.06 26.99,105.41 28.26,106.68 54.93,106.68 57.15,104.46 57.15,55.56 58.1,54.61 60.33,54.61 62.87,57.15 ARDUINO_NANO2.11 | 26.99,99.06 26.99,91.76 | 26.99,91.76 26.99,87.63 26.35,87 C19.1 26.35,84.1 29.21,81.24 L1.2 | D6.C 28.26,97.79 26.99,99.06 | D5.A 30.48,90.17 28.57,90.17 26.99,91.76
TRIG  (via drill 0.64 pad 1.78)
  Top 0.813: v75.88,45.09 v75.88,61.59
  Bottom 0.813: v75.88,45.09 75.88,42.55 74.61,41.27 69.53,41.27 68.58,40.32 68.58,33.02 67.31,31.75 ARDUINO_NANO2.1 | ULTRASONIC(RX-TX).2 58.42,120.65 60.61,122.84 75.28,122.84 79.38,118.75 79.38,90.17 74.3,85.09 74.3,67.94 75.88,66.36 v75.88,61.59

### Text on the board
Bottom: PHYSICS WITH | ARDUINO
tPlace: THERMOCOUPLE / PINOUT
tNames: THERM | GND | +5V | SCK(6) | SO(11) | CS(4|10) | RGB | RLC | DIODE / TRACER